# Altium schematic sheet Input Transceivers.SchDoc
size A2; SheetNumber: 5; SheetTotal: 8; SPICEModelCacheFVAKUUFU: <root> / <DocumentId>FVAKUUFU</DocumentId> / </root>
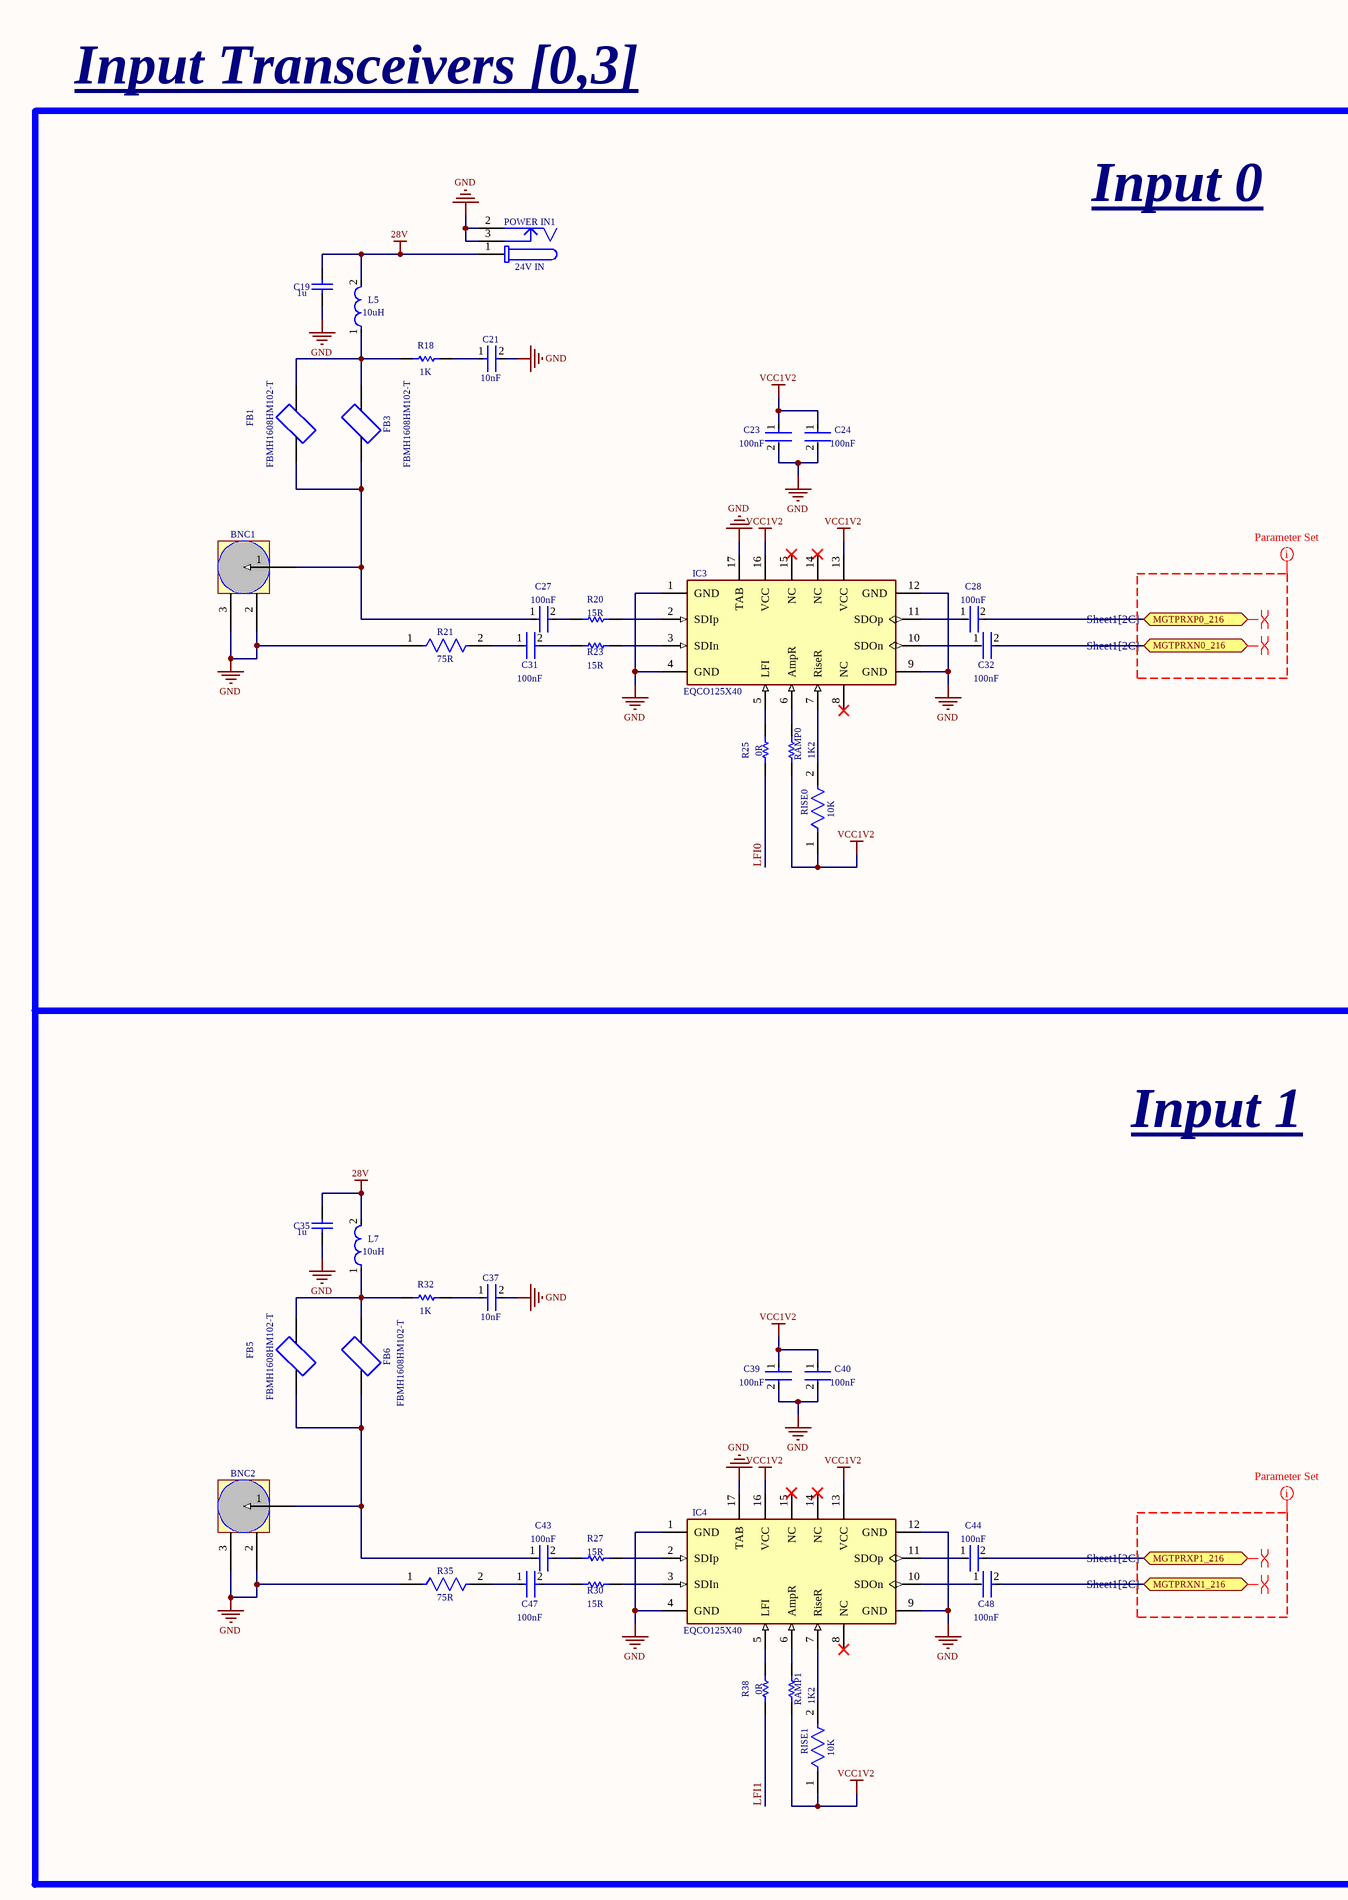
[diagram p0: Input Transceivers.SchDoc, left]
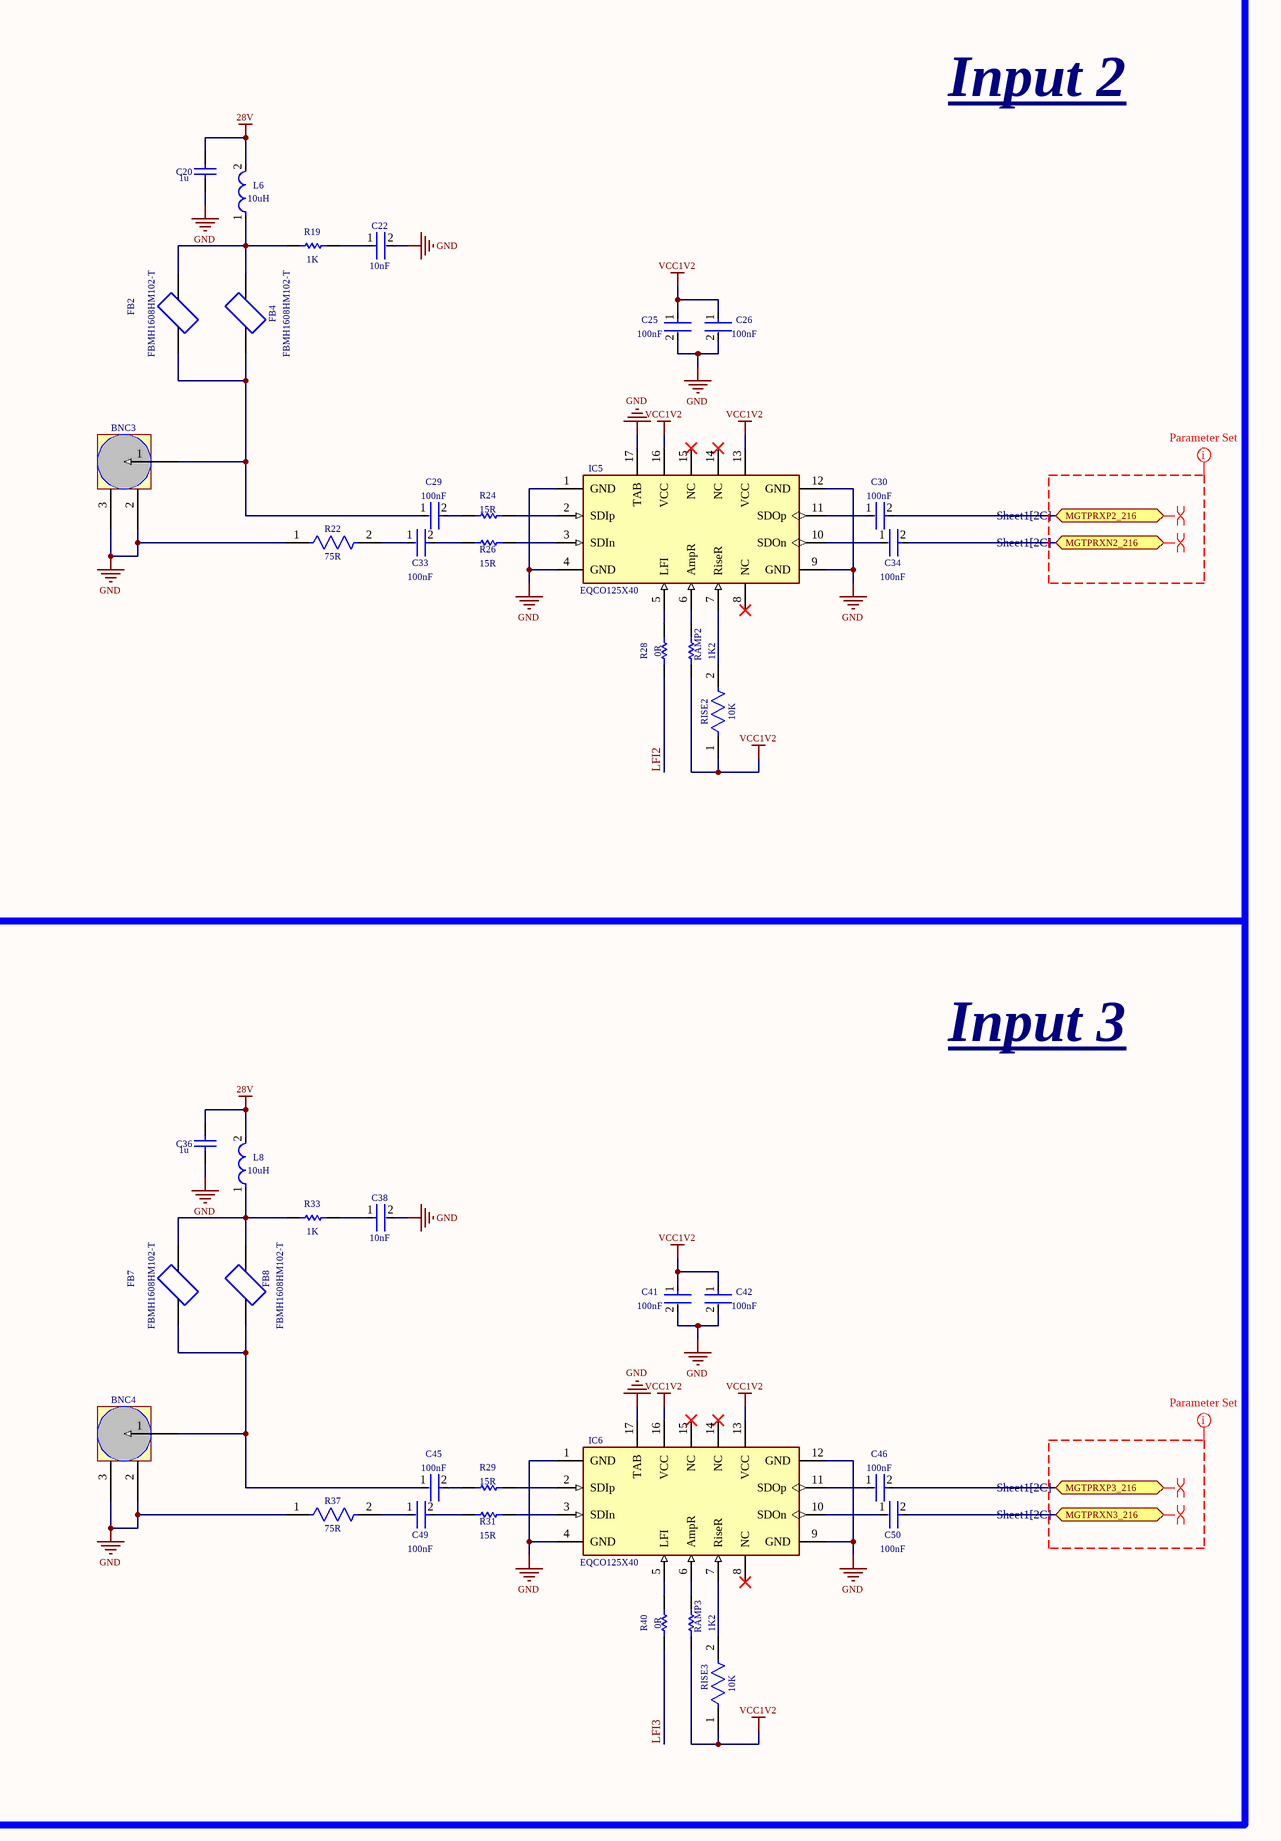
[diagram p1: Input Transceivers.SchDoc, right]

## Parts
BNC1  Amphenol_BNC_HD_034_1018  [PCBComponent_1 - duplicate]  (value not drawn)
BNC2  Amphenol_BNC_HD_034_1018  [PCBComponent_1 - duplicate]  (value not drawn)
BNC3  Amphenol_BNC_HD_034_1018  [PCBComponent_1 - duplicate]  (value not drawn)
BNC4  Amphenol_BNC_HD_034_1018  [PCBComponent_1 - duplicate]  (value not drawn)
C19  1u  [CAPC2013X135X45LL10T25]
C20  1u  [CAPC2013X135X45LL10T25]
C21  10nF  [FP-CL165-IPC_C]
C22  10nF  [FP-CL165-IPC_C]
C23  100nF  [FP-C0402-BB-MFG]
C24  100nF  [FP-C0402-BB-MFG]
C25  100nF  [FP-C0402-BB-MFG]
C26  100nF  [FP-C0402-BB-MFG]
C27  100nF  [FP-GRM15-MFG]
C28  100nF  [FP-GRM15-MFG]
C29  100nF  [FP-GRM15-MFG]
C30  100nF  [FP-GRM15-MFG]
C31  100nF  [FP-GRM15-MFG]
C32  100nF  [FP-GRM15-MFG]
C33  100nF  [FP-GRM15-MFG]
C34  100nF  [FP-GRM15-MFG]
C35  1u  [CAPC2013X135X45LL10T25]
C36  1u  [CAPC2013X135X45LL10T25]
C37  10nF  [FP-CL165-IPC_C]
C38  10nF  [FP-CL165-IPC_C]
C39  100nF  [FP-C0402-BB-MFG]
C40  100nF  [FP-C0402-BB-MFG]
C41  100nF  [FP-C0402-BB-MFG]
C42  100nF  [FP-C0402-BB-MFG]
C43  100nF  [FP-GRM15-MFG]
C44  100nF  [FP-GRM15-MFG]
C45  100nF  [FP-GRM15-MFG]
C46  100nF  [FP-GRM15-MFG]
C47  100nF  [FP-GRM15-MFG]
C48  100nF  [FP-GRM15-MFG]
C49  100nF  [FP-GRM15-MFG]
C50  100nF  [FP-GRM15-MFG]
FB1  FBMH1608HM102-T  [FBMH1608HM102-T]
FB2  FBMH1608HM102-T  [FBMH1608HM102-T]
FB3  FBMH1608HM102-T  [FBMH1608HM102-T]
FB4  FBMH1608HM102-T  [FBMH1608HM102-T]
FB5  FBMH1608HM102-T  [FBMH1608HM102-T]
FB6  FBMH1608HM102-T  [FBMH1608HM102-T]
FB7  FBMH1608HM102-T  [FBMH1608HM102-T]
FB8  FBMH1608HM102-T  [FBMH1608HM102-T]
IC3  EQCO125X40  [EQCO125X40]
IC4  EQCO125X40  [EQCO125X40]
IC5  EQCO125X40  [EQCO125X40]
IC6  EQCO125X40  [EQCO125X40]
L5  10uH  [FP-1812PS-MFG]
L6  10uH  [FP-1812PS-MFG]
L7  10uH  [FP-1812PS-MFG]
L8  10uH  [FP-1812PS-MFG]
POWER_IN1  24V IN  [694102107102]
R18  1K  [RESC1608X55X30LL15T15]
R19  1K  [RESC1608X55X30LL15T15]
R20  15R  [RESC1005X40X25ML10T10]
R21  75R  [FP-ERJ2RK-IPC_B]
R22  75R  [FP-ERJ2RK-IPC_B]
R23  15R  [RESC1005X40X25ML10T10]
R24  15R  [RESC1005X40X25ML10T10]
R25  0R  [RESC1005X40X25NL05T10]
R26  15R  [RESC1005X40X25ML10T10]
R27  15R  [RESC1005X40X25ML10T10]
R28  0R  [RESC1005X40X25NL05T10]
R29  15R  [RESC1005X40X25ML10T10]
R30  15R  [RESC1005X40X25ML10T10]
R31  15R  [RESC1005X40X25ML10T10]
R32  1K  [RESC1608X55X30LL15T15]
R33  1K  [RESC1608X55X30LL15T15]
R35  75R  [FP-ERJ2RK-IPC_B]
R37  75R  [FP-ERJ2RK-IPC_B]
R38  0R  [RESC1005X40X25NL05T10]
R40  0R  [RESC1005X40X25NL05T10]
RAMP0  1K2  [RESC1608X55X25LL10T15]
RAMP1  1K2  [RESC1608X55X25LL10T15]
RAMP2  1K2  [RESC1608X55X25LL10T15]
RAMP3  1K2  [RESC1608X55X25LL10T15]
RISE0  10K  [FP-RC0603-0_55-IPC_C]
RISE1  10K  [FP-RC0603-0_55-IPC_C]
RISE2  10K  [FP-RC0603-0_55-IPC_C]
RISE3  10K  [FP-RC0603-0_55-IPC_C]

## Ports
MGTPRXN0_216 (bidir, see Sheet1[2C]), MGTPRXN1_216 (bidir, see Sheet1[2C]), MGTPRXN2_216 (bidir, see Sheet1[2C]), MGTPRXN3_216 (bidir, see Sheet1[2C]), MGTPRXP0_216 (bidir, see Sheet1[2C]), MGTPRXP1_216 (bidir, see Sheet1[2C]), MGTPRXP2_216 (bidir, see Sheet1[2C]), MGTPRXP3_216 (bidir, see Sheet1[2C])

## Nets
28V: C19.2 C20.2 C35.2 C36.2 L5.2 L6.2 L7.2 L8.2 POWER_IN1.1
GND: BNC1.2 BNC1.3 BNC2.2 BNC2.3 BNC3.2 BNC3.3 BNC4.2 BNC4.3 C19.1 C20.1 C21.2 C22.2 C23.2 C24.2 C25.2 C26.2 C35.1 C36.1 C37.2 C38.2 C39.2 C40.2 C41.2 C42.2 IC3.1(GND) IC3.4(GND) IC3.9(GND) IC3.12(GND) IC3.17(TAB) IC4.1(GND) IC4.4(GND) IC4.9(GND) IC4.12(GND) IC4.17(TAB) IC5.1(GND) IC5.4(GND) IC5.9(GND) IC5.12(GND) IC5.17(TAB) IC6.1(GND) IC6.4(GND) IC6.9(GND) IC6.12(GND) IC6.17(TAB) POWER_IN1.2 POWER_IN1.3 R21.1 R22.1 R35.1 R37.1
VCC1V2: C23.1 C24.1 C25.1 C26.1 C39.1 C40.1 C41.1 C42.1 IC3.13(VCC) IC3.16(VCC) IC4.13(VCC) IC4.16(VCC) IC5.13(VCC) IC5.16(VCC) IC6.13(VCC) IC6.16(VCC) RAMP0.1 RAMP1.1 RAMP2.1 RAMP3.1 RISE0.1 RISE1.1 RISE2.1 RISE3.1
LFI0: R25.1
LFI1: R38.1
LFI2: R28.1
LFI3: R40.1
MGTPRXN0_216: C32.2 ; port MGTPRXN0_216
MGTPRXN1_216: C48.2 ; port MGTPRXN1_216
MGTPRXN2_216: C34.2 ; port MGTPRXN2_216
MGTPRXN3_216: C50.2 ; port MGTPRXN3_216
MGTPRXP0_216: C28.2 ; port MGTPRXP0_216
MGTPRXP1_216: C44.2 ; port MGTPRXP1_216
MGTPRXP2_216: C30.2 ; port MGTPRXP2_216
MGTPRXP3_216: C46.2 ; port MGTPRXP3_216
NetBNC1_1: BNC1.1 C27.1 FB1.1 FB3.1
NetBNC2_1: BNC2.1 C43.1 FB5.1 FB6.1
NetBNC3_1: BNC3.1 C29.1 FB2.1 FB4.1
NetBNC4_1: BNC4.1 C45.1 FB7.1 FB8.1
NetC21_1: C21.1 R18.2
NetC22_1: C22.1 R19.2
NetC27_2: C27.2 R20.1
NetC28_1: C28.1 IC3.11(SDOp)
NetC29_2: C29.2 R24.1
NetC30_1: C30.1 IC5.11(SDOp)
NetC31_1: C31.1 R21.2
NetC31_2: C31.2 R23.1
NetC32_1: C32.1 IC3.10(SDOn)
NetC33_1: C33.1 R22.2
NetC33_2: C33.2 R26.1
NetC34_1: C34.1 IC5.10(SDOn)
NetC37_1: C37.1 R32.2
NetC38_1: C38.1 R33.2
NetC43_2: C43.2 R27.1
NetC44_1: C44.1 IC4.11(SDOp)
NetC45_2: C45.2 R29.1
NetC46_1: C46.1 IC6.11(SDOp)
NetC47_1: C47.1 R35.2
NetC47_2: C47.2 R30.1
NetC48_1: C48.1 IC4.10(SDOn)
NetC49_1: C49.1 R37.2
NetC49_2: C49.2 R31.1
NetC50_1: C50.1 IC6.10(SDOn)
NetFB1_2: FB1.2 FB3.2 L5.1 R18.1
NetFB2_2: FB2.2 FB4.2 L6.1 R19.1
NetFB5_2: FB5.2 FB6.2 L7.1 R32.1
NetFB7_2: FB7.2 FB8.2 L8.1 R33.1
NetIC3_2: IC3.2(SDIp) R20.2
NetIC3_3: IC3.3(SDIn) R23.2
NetIC3_5: IC3.5(LFI) R25.2
NetIC3_6: IC3.6(AmpR) RAMP0.2
NetIC3_7: IC3.7(RiseR) RISE0.2
NetIC4_2: IC4.2(SDIp) R27.2
NetIC4_3: IC4.3(SDIn) R30.2
NetIC4_5: IC4.5(LFI) R38.2
NetIC4_6: IC4.6(AmpR) RAMP1.2
NetIC4_7: IC4.7(RiseR) RISE1.2
NetIC5_2: IC5.2(SDIp) R24.2
NetIC5_3: IC5.3(SDIn) R26.2
NetIC5_5: IC5.5(LFI) R28.2
NetIC5_6: IC5.6(AmpR) RAMP2.2
NetIC5_7: IC5.7(RiseR) RISE2.2
NetIC6_2: IC6.2(SDIp) R29.2
NetIC6_3: IC6.3(SDIn) R31.2
NetIC6_5: IC6.5(LFI) R40.2
NetIC6_6: IC6.6(AmpR) RAMP3.2
NetIC6_7: IC6.7(RiseR) RISE3.2

Not connected (* = marked no-connect by the designer): IC3 8(NC)* 14(NC)* 15(NC)*; IC4 8(NC)* 14(NC)* 15(NC)*; IC5 8(NC)* 14(NC)* 15(NC)*; IC6 8(NC)* 14(NC)* 15(NC)*

## Layout directives
differential pair: MGTPRXN0_216, MGTPRXN1_216, MGTPRXN2_216, MGTPRXN3_216, MGTPRXP0_216, MGTPRXP1_216, MGTPRXP2_216, MGTPRXP3_216

## Notes on the sheet
- Input Transceivers [0,3]
- Input 0
- Input 2
- Input 1
- Input 3

## Library data of the parts
BNC1-BNC4 = Component_1_3
C19 C20 C35 C36 = CMP-1036-04761-2: Manufacturer: Murata; Part Number: GRM21BR71H105KA12L
C21 C22 C37 C38 = CMP-13271-000387-1: Cap Ceramic 10nF 50V X7R ±10% SMD 0402 +125°C Paper T/R; Depth: 0.5mm; Length: 1mm; Lead Free: Lead Free; Case Code (Metric): 1005; Width: 0.02inch; Min Operating Temperature: -55°C; Thickness: 0.022inch; Package Quantity: 1; Mount: Surface Mount; Height: 0.5mm; Voltage: 50V; Material: Ceramic; Tolerance: 10%; Case Code (Imperial): 0402; Radiation Hardening: No; Case/Package: 0402; Max Operating Temperature: 125°C; Voltage Rating (DC): 50V; Contact Plating: Tin; Packaging: Tape and Reel; Voltage Rating: 50V; Capacitance: 10nF; Dielectric: X7R
C23-C26 C39-C42 = CMP-2008-02108-2: CAP CER 0.1UF 16V X7R 0402; Manufacturer: Kemet; Manufacturer Part Number: C0402C104K4RACTU; Value: 0.10 μF; Tolerance: 0.1; Material: Ceramic; Temperature Coefficient: 15%; Voltage Rating: 16 V; Package: C0402-BB; Automotive: No; Ipc Land Pattern Name: CAPC10050X50; Device Class L3: Ceramic Capacitors; Capacitance: 0.10 μF; Octopart: https://octopart.com/c0402c104k4ractu-kemet-94158; Temperature Characteristic: X7R; Mouser Description: Cap Ceramic 0.1uF 16V X7R 10% SMD 0402 125?C Paper T/R - Tape and Reel (Alt: C0402C104K4RAC TU); ComponentLink2Description: Datasheet; Temperature Range Low: -55°C; RoHS: TRUE; Device Class L1: Passive Components; Temperature Range High: +125°C; Device Class L2: Capacitors; ComponentLink2URL: https://content.kemet.com/datasheets/KEM_C1002_X7R_SMD.pdf; Category: Cap; Height: 0.55mm; Temperature: -55°C to +125°C; Lead Free: Yes; Digikey Description: CAP CER 0.1UF 16V X7R 0402
C27-C34 C43-C50 = CMP-2100-03641-2: CAP CER 0.1UF 16V X7R 0402; Manufacturer Part Number: GRM155R71C104KA88D; Manufacturer: Murata; Standoff Height: 0mm; Tolerance: 10%; Voltage Rating: 16Vdc; Material: Ceramic; Capacitance: 0.10μF; Value: 0.10μF; RoHS: TRUE; Temperature Characteristic: X7R; Octopart: https://octopart.com/grm155r71c104ka88d-murata-196880; Digikey Description: CAP CER 0.1UF 16V X7R 0402; Device Class L3: Ceramic Capacitors; Height: 0.55mm; ComponentLink2Description: Datasheet; Temperature Range Low: -55°C; Ipc Land Pattern Name: CAPC10050X219; ComponentLink2URL: https://search.murata.co.jp/Ceramy/image/img/A01X/G101/ENG/GRM155R71H471KA01-01A.pdf; Device Class L1: Passive Components; Lead Free: yes; Category: Cap; Package: GRM15; Temperature: -55°C to +125°C; Device Class L2: Capacitors; Temperature Range High: +125°C; Mouser Description: 0402 0.1 uF 16V ±10 % Tolerance X7R SMT Multilayer Ceramic Capacitor
FB1-FB8 = FBMH1608HM102-T: Jumper; Part_Number: J00001; ID: 110; Mounting_Type: SMT; Part_Name: Jumper; ComponentLink1Description: Datasheet
IC3-IC6 = EQCO125X40: 12.5 Gbps Asymmetric Equalizer/Driver/Repeater; Part_Number: J00001; Part_Name: Jumper; ID: 110; Mounting_Type: SMT; ComponentLink1Description: Datasheet
L5-L8 = CMP-11268-000188-1: Fixed Inductors 1812PS Hi SRF Shlded 10uH 5 % 1.7 A; Core Material: Ferrite; Test Frequency: 100kHz; DC Resistance (DCR): 170mR; Self Resonant Frequency: 120MHz; Q Factor: 40; Shielding: Shielded; Tolerance: 5%; Max DC Current: 1.7A; Inductance: 10uH; Height: 3.81mm; Length: 5.87mm; Case/Package: 1812; Series: 1812PS; Packaging: Tape and Reel; Package Quantity: 600; Width: 4.98mm; Max Operating Temperature: 105°C; Termination: SMD/SMT; Lead Free: Contains Lead; Min Operating Temperature: -40°C; RoHS Compliant: Yes
POWER_IN1 = CMP-1502-00174-2: NexarPartId: 52645180; Connector Type: Power; Insulation Resistance: 100MΩ; Gender: Male; Current Rating: 5A; Voltage Rating: 18V; Shielding: Unshielded; Mount: Surface Mount; Packaging: Tape and Reel; Max Operating Temperature: 85°C; Color: Black; Contact Plating: Tin; Min Operating Temperature: -40°C; Housing Material: Polyamide; Termination: SMD/SMT; RoHS: Compliant; Contact Gender: Female; REACH SVHC: Unknown; Voltage Rating (DC): 18V; Operating Supply Voltage: 18V; Flammability Rating: UL94 V-0
R18 R19 R32 R33 = CMP-2000-00180-1: Part Number: ERJ-3EKF1001V; Manufacturer: Panasonic
R20 R23 R24 R26 R27 R29-R31 = CMP-2002-05954-1: Manufacturer: Multicomp; Part Number: MC00625W0402115R
R21 R22 R35 R37 = CMP-2002-01061-2: RES SMD 75 OHM 1% 1/10W 0402; Max Power Dissipation: 100mW; Voltage Rating: 50V; Temperature Coefficient: 100ppm/°C; Radiation Hardening: No; Resistor Type: Thick Film; Contact Plating: Tin; Military Standard: Not; Package Quantity: 1; Packaging: Tape and Reel; Resistance Tolerance: 1%; RoHS Compliant: Yes; Depth: 0.5mm; Construction: Rectangular; Series: ERJ; Resistance: 75R; Lead Free: Lead Free; REACH SVHC: No SVHC; Power Rating: 100mW; Length: 1mm; Termination: SMD/SMT; Case Code (Metric): 1005; Features: Automotive AEC-Q200; Case/Package: 0402; Technology: THICK FILM; Case Code (Imperial): 0402; Tolerance: 1%; Max Operating Temperature: 155°C; Size Code: 0402; Min Operating Temperature: -55°C; Number of Terminations: 2; Voltage Rating (DC): 50V; Height: 0.35mm; Mount: Surface Mount; Width: 0.02inch
R25 R28 R38 R40 = CMP-1011-00001-2: Manufacturer: Yageo / Phycomp; Part Number: RC0402JR-070RL
RAMP0-RAMP3 = CMP-1659-00042-1: Chip Resistor, 1.2 KOhm, +/- 1%, 0.1 W, -55 to 155 degC, 0603 (1608 Metric), RoHS, Tape and Reel; Resistance: 825 kohm; Voltage Rating: 50 V; Power Rating: 100 mW; Case\Package: 0603; DatasheetVersion: Rev. 4, 02/2016; Package Quantity: 5000; Min Operating Temperature: -55 degC; PackageReference: 0603; ComponentLink1Description: Manufacturer URL; Tolerance: 1%; ComponentLink2Description: Datasheet; Packaging: Tape and Reel; PackageDescription: 2-Pin Surface Mount Device, Body 1.6 x 0.8 mm; Width: 0.8 mm; ComponentLink2URL: http://www.yageo.com/documents/recent/PYu-RC_Group_51_RoHS_L_04.pdf; ComponentLink1URL: http://www.yageo.com/; Max Operating Temperature: 155 degC; RoHSCompliant: true; Height: 0.45 mm; Case Code (Imperial): 0603; Case Code (Metric): 1608; Length: 1.6 mm
RISE0-RISE3 = CMP-2100-03664-2: RES 10K OHM 1% 1/10W 0603; Voltage Rating: 75V; Voltage Rating (DC): 50V; Resistance: 10kR; Power Rating: 100mW; Temperature Coefficient: 100ppm/°C; Depth: 0.8mm; Termination: SMD/SMT; Resistor Type: Thick Film; Series: RC; Construction: Rectangular; Features: Moisture Resistant; Packaging: Tape and Reel; Min Operating Temperature: -55°C; Number of Terminations: 2; Lead Pitch: 0.3mm; RoHS Compliant: Yes; Case/Package: 0603; Resistance Tolerance: 1%; Military Standard: Not; Weight: 7.1E-05oz; Number of Pins: 2; Tolerance: 1%; Length: 1.6mm; Case Code (Imperial): 0603; Lead Free: Lead Free; Width: 0.8mm; Max Power Dissipation: 100mW; Height: 0.45mm; Max Operating Temperature: 155°C; Case Code (Metric): 1608; Size Code: 0603